# EAGLE design Reactor_Zero (EAGLE 9.5.1)
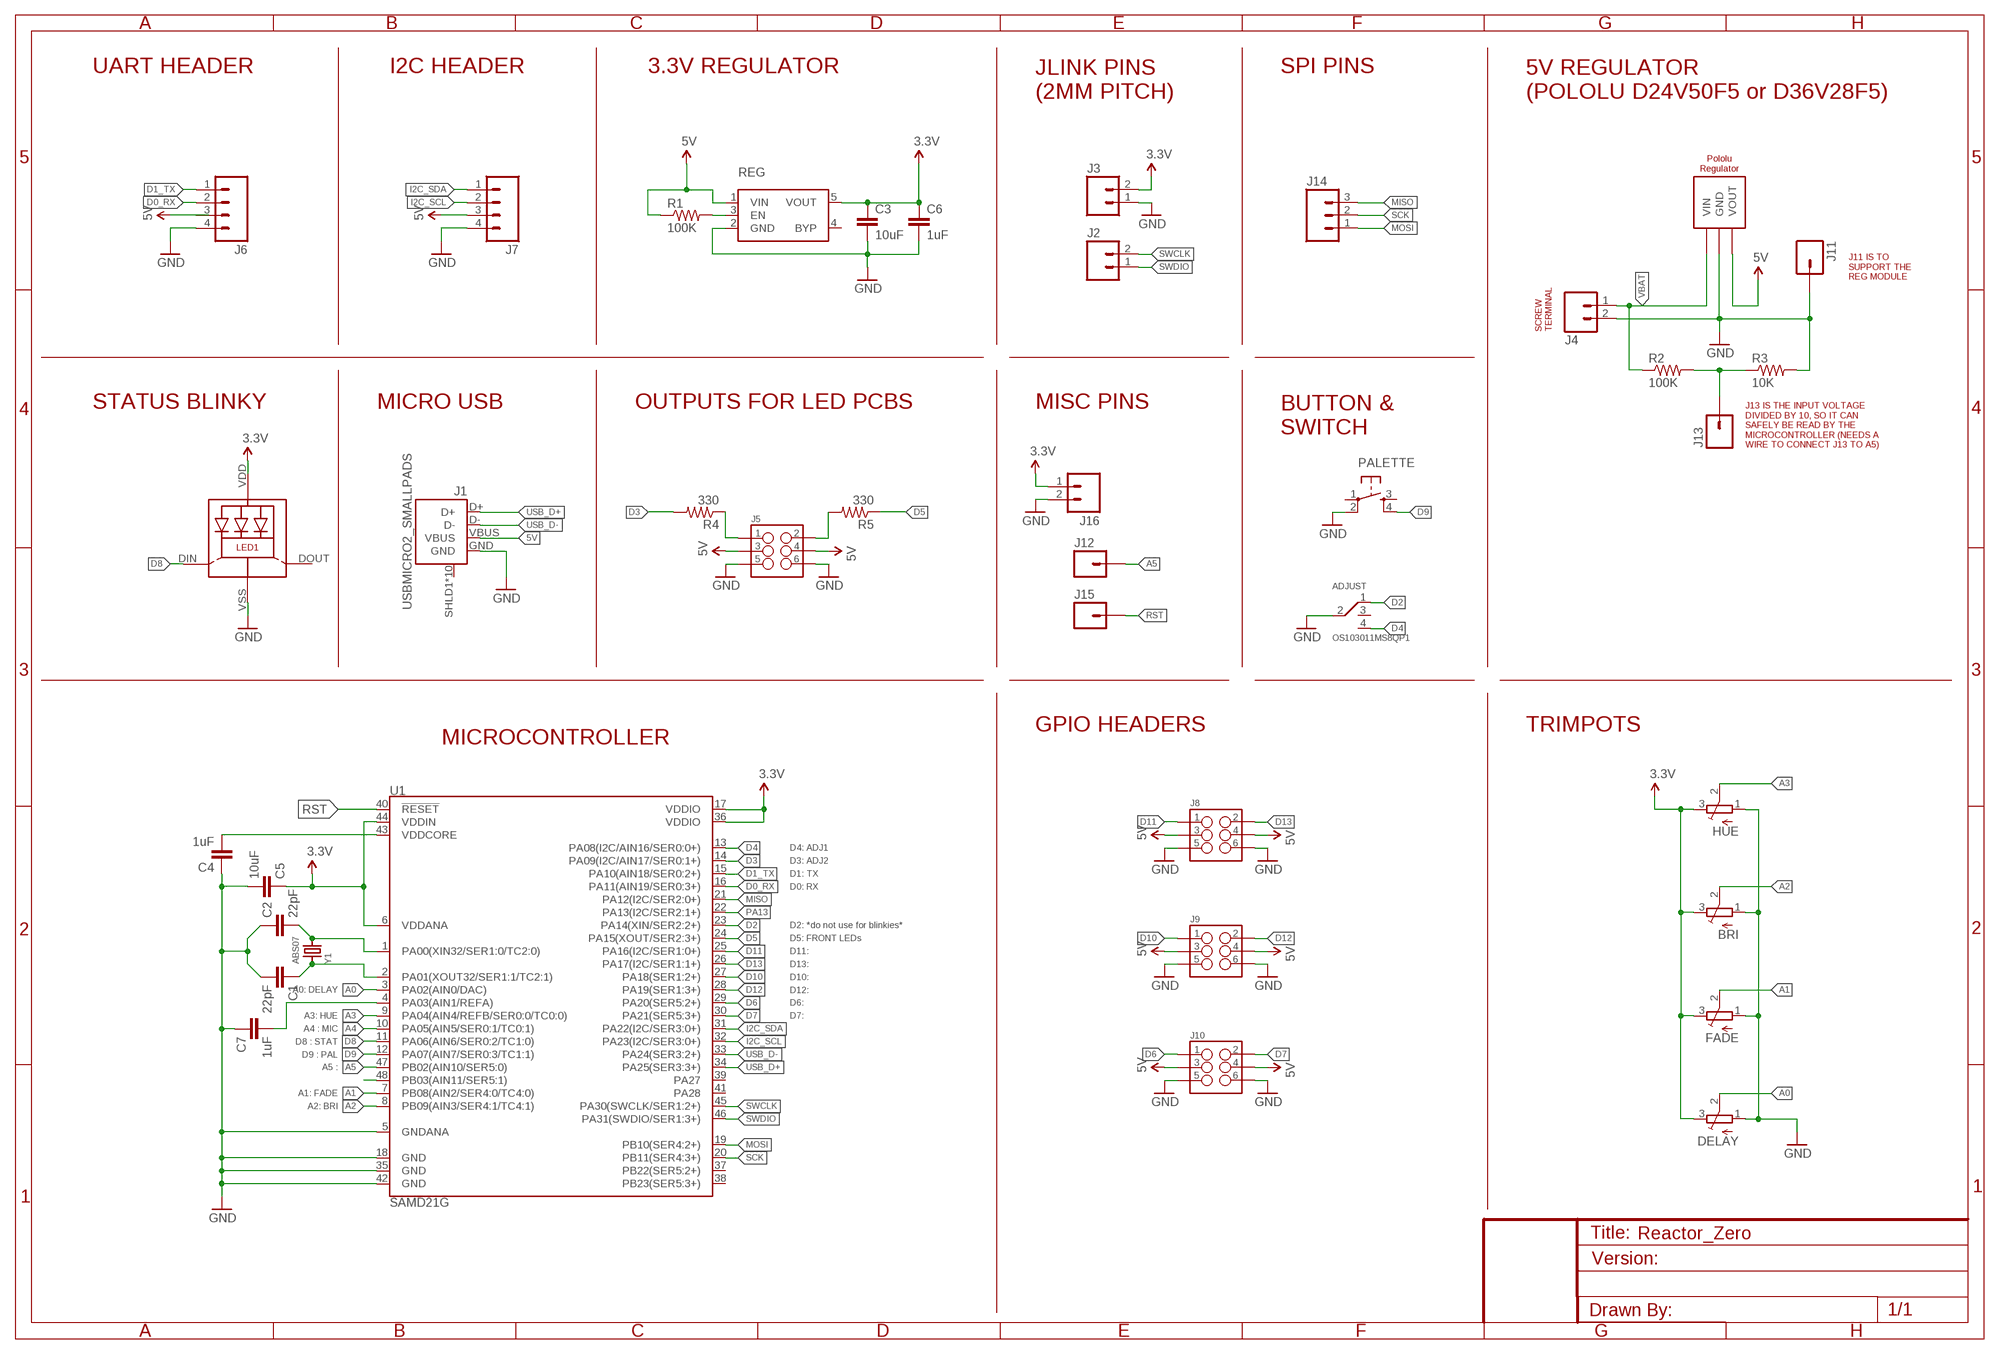
[diagram p0: schematic, sheet 1]

## Parts
ADJUST  OS103011MS8QP1  [OS103011MS8QP1]
BRI  TRIMPOTEVM3V  [EVM3V]
C1  22pF  C-EUC0603K  [C0603K]
C2  22pF  C-EUC0603K  [C0603K]
C3  10uF  C-EUC0805K  [C0805K]
C4  1uF  C-EUC0805K  [C0805K]
C5  10uF  C-EUC0805K  [C0805K]
C6  1uF  C-EUC0805K  [C0805K]
C7  1uF  C-EUC0805K  [C0805K]
DELAY  TRIMPOTEVM3V  [EVM3V]
FADE  TRIMPOTEVM3V  [EVM3V]
HUE  TRIMPOTEVM3V  [EVM3V]
J1  USBMICRO2_SMALLPADS  [USB-MICROB-10118194_SMALLPADS]
J2  M022MM  [1X02_NO_SILK_2MM]
J3  M022MM  [1X02_NO_SILK_2MM]
J4  M025MM  [SCREWTERMINAL-5MM-2]
J5  M03X22X3_SILK_MALE_PTH  [2X3]
J6  M04PTH  [1X04]
J7  M04PTH  [1X04]
J8  M03X22X3_SILK_MALE_PTH  [2X3]
J9  M03X22X3_SILK_MALE_PTH  [2X3]
J10  M03X22X3_SILK_MALE_PTH  [2X3]
J11  M01PTH  [1X01]
J12  M01PTH  [1X01]
J13  M01PTH  [1X01]
J14  M03PTH  [1X03]
J15  M01PTH  [1X01]
J16  M02PTH  [1X02]
LED1  WS2812BSK6812MINI-WIDE  [SK6812MINI-WIDE]
PALETTE  TAC_SWITCHPTH  [TACTILE-PTH]
R1  100K  R-US_R0603  [R0603]
R2  100K  R-US_R0603  [R0603]
R3  10K  R-US_R0603  [R0603]
R4  330  R-US_R0603  [R0603]
R5  330  R-US_R0603  [R0603]
REG  SPX3819  [SOT23-5]
U1  SAMD21G  ATSAMD21G-A_SMPADS  [TQFP-48_SMALL_PADS]
U$1  POLOLU_REGD24V50FS_NO_HOLES  [D24V50F5_NO_HOLES]
Y1  ABS07  ABRACON_CRYSTAL.ABS07  [ABS07]

## Nets
3.3V [PWR]: BRI.3(E) C3.1 C5.1 C6.1 DELAY.3(E) FADE.3(E) HUE.3(E) J3.2 J16.1 LED1.VDD REG.5(VOUT) U1.6(VDDANA) U1.17(VDDIO) U1.36(VDDIO) U1.44(VDDIN)
5V [PWR]: J1.VBUS J5.3 J5.4 J6.3 J7.3 J8.3 J8.4 J9.3 J9.4 J10.3 J10.4 R1.1 REG.1(VIN) U$1.VOUT
A0: DELAY.2(S) U1.3(PA02(AIN0/DAC))
A1: FADE.2(S) U1.7(PB08(AIN2/SER4:0/TC4:0))
A2: BRI.2(S) U1.8(PB09(AIN3/SER4:1/TC4:1))
A3: HUE.2(S) U1.9(PA04(AIN4/REFB/SER0:0/TC0:0))
A4: U1.10(PA05(AIN5/SER0:1/TC0:1))
A5: J12.1 U1.47(PB02(AIN10/SER5:0))
AREF: C7.2 U1.4(PA03(AIN1/REFA))
D0_RX: J6.2 U1.16(PA11(AIN19/SER0:3+))
D1_TX: J6.1 U1.15(PA10(AIN18/SER0:2+))
D2: ADJUST.1(T1) U1.23(PA14(XIN/SER2:2+))
D3: R4.2 U1.14(PA09(I2C/AIN17/SER0:1+))
D4: ADJUST.4(T3) U1.13(PA08(I2C/AIN16/SER0:0+))
D5: R5.1 U1.24(PA15(XOUT/SER2:3+))
D6: J10.1 U1.29(PA20(SER5:2+))
D7: J10.2 U1.30(PA21(SER5:3+))
D8: LED1.DIN(DI) U1.11(PA06(AIN6/SER0:2/TC1:0))
D9: PALETTE.4 U1.12(PA07(AIN7/SER0:3/TC1:1))
D10: J9.1 U1.27(PA18(SER1:2+))
D11: J8.1 U1.25(PA16(I2C/SER1:0+))
D12: J9.2 U1.28(PA19(SER1:3+))
D13: J8.2 U1.26(PA17(I2C/SER1:1+))
DIV: J13.1 R2.2 R3.1
GND [PWR]: ADJUST.2(P) BRI.1(A) C1.2 C2.1 C3.2 C4.1 C5.2 C6.2 C7.1 DELAY.1(A) FADE.1(A) HUE.1(A) J1.GND J3.1 J4.2 J5.5 J5.6 J6.4 J7.4 J8.5 J8.6 J9.5 J9.6 J10.5 J10.6 J11.1 J16.2 LED1.VSS(GND) PALETTE.2 R3.2 REG.2(GND) U1.5(GNDANA) U1.18(GND) U1.35(GND) U1.42(GND) U$1.GND1(GND) U$1.GND2(GND)
I2C_SCL: J7.2 U1.32(PA23(I2C/SER3:0+))
I2C_SDA: J7.1 U1.31(PA22(I2C/SER3:0+))
MISO: J14.3 U1.21(PA12(I2C/SER2:0+))
MOSI: J14.1 U1.19(PB10(SER4:2+))
N$1: C2.2 U1.1(PA00(XIN32/SER1:0/TC2:0)) Y1.2
N$2: C1.1 U1.2(PA01(XOUT32/SER1:1/TC2:1)) Y1.1
N$3: J5.2 R5.2
N$4: R1.2 REG.3(EN)
N$5: J5.1 R4.1
N$6: C4.2 U1.43(VDDCORE)
N$11: U1.48(PB03(AIN11/SER5:1))
PA13: U1.22(PA13(I2C/SER2:1+))
RST: J15.1 U1.40(!RESET!)
SCK: J14.2 U1.20(PB11(SER4:3+))
SWCLK: J2.2 U1.45(PA30(SWCLK/SER1:2+))
SWDIO: J2.1 U1.46(PA31(SWDIO/SER1:3+))
USB_D+: J1.D+ U1.34(PA25(SER3:3+))
USB_D-: J1.D- U1.33(PA24(SER3:2+))
VBAT [BIGPWR]: J4.1 R2.1 U$1.VIN
Unconnected: ADJUST.3(T2) J1.SHLD1(SHIELD) J1.SHLD2(SHIELD) J1.SHLD3(SHIELD) J1.SHLD4(SHIELD) J1.SHLD5(SHIELD) J1.SHLD6(SHIELD) J1.SHLD7(SHIELD) J1.SHLD8(SHIELD) J1.SHLD9(SHIELD) J1.SHLD10(SHIELD) LED1.DOUT(DO) PALETTE.1 PALETTE.3 REG.4(BYP) U1.37(PB22(SER5:2+)) U1.38(PB23(SER5:3+)) U1.39(PA27) U1.41(PA28)

## Notes on the sheet
- UART HEADER | I2C HEADER | 3.3V REGULATOR | SPI PINS
- JLINK PINS
  (2MM PITCH)
- 5V REGULATOR
  (POLOLU D24V50F5 or D36V28F5)
- J11 IS TO
  SUPPORT THE
  REG MODULE
- SCREW
  TERMINAL
- STATUS BLINKY | MICRO USB | OUTPUTS FOR LED PCBS | MISC PINS
- BUTTON &
  SWITCH
- J13 IS THE INPUT VOLTAGE
  DIVIDED BY 10, SO IT CAN
  SAFELY BE READ BY THE
  MICROCONTROLLER (NEEDS A
  WIRE TO CONNECT J13 TO A5)
- GPIO HEADERS | TRIMPOTS
- MICROCONTROLLER
- D4: ADJ1
  D3: ADJ2
  D1: TX
  D0: RX
  
  
  D2: *do not use for blinkies*
  D5: FRONT LEDs
  D11: 
  D13: 
  D10: 
  D12: 
  D6: 
  D7:
- A0: DELAY
  
  A3: HUE
  A4 : MIC
  D8 : STAT
  D9 : PAL
  A5 :
  
  A1: FADE
  A2: BRI

## Library data of the parts
ADJUST = rseries:OS103011MS8QP1
BRI DELAY FADE HUE = rseries:TRIMPOT: Panasonic SMT trimmer potentiometer part number EVM3V http://industrial.panasonic.com/www-data/pdf/AOI0000/AOI0000CE4.pdf
C1-C7 = rcl:C-EU: CAPACITOR, European symbol
J1 = rseries:USB: USB Connectors
J2 J3 = rseries:M02: Standard 2-pin 0.1" header. Use with - straight break away headers ( PRT-00116) - right angle break away headers (PRT-00553) - swiss pins (PRT-00743) - machine pins (PRT-00117) - female headers (PRT-00115) Molex polarized connector foot print use with: PRT-08233 with associated crimp pins and housings. 2.54_SCREWTERM for use with PRT-10571. 3.5mm Screw Terminal footprints for PRT-08084 5mm Screw Terminal footprints for use with PRT-08432
J4 = rseries:M02: Standard 2-pin 0.1" header. Use with - straight break away headers ( PRT-00116) - right angle break away headers (PRT-00553) - swiss pins (PRT-00743) - machine pins (PRT-00117) - female headers (PRT-00115) Molex polarized connector foot print use with: PRT-08233 with associated crimp pins and housings. 2.54_SCREWTERM for use with PRT-10571. 3.5mm Screw Terminal footprints for PRT-08084 5mm Screw Terminal footprints for use with PRT-08432; STOREFRONT_ID: PRT-08432
J5 J8-J10 = SparkFun-Connectors:M03X2: 2x3 .1" header. Shrouded, with keying- CONN-10681 SMT- CONN-11415 Pogo pins- HW-11044; PROD_ID: CONN-09701
J6 J7 = SparkFun-Connectors:M04: Header 4 Standard 4-pin 0.1" header. Use with straight break away headers (SKU : PRT-00116), right angle break away headers (PRT-00553), swiss pins (PRT-00743), machine pins (PRT-00117), and female headers (PRT-00115). Molex polarized connector foot print use with SKU : PRT-08231 with associated crimp pins and housings. 1MM SMD Version SKU: PRT-10208; PROD_ID: CONN-09696
J11-J13 J15 = SparkFun-Connectors:M01: Header 1 Standard 1-pin 0.1" header. Use with straight break away headers (SKU : PRT-00116), right angle break away headers (PRT-00553), swiss pins (PRT-00743), machine pins (PRT-00117), and female headers (PRT-00115). SMTSO-256-ET is a "flush mount" nut for a 4-40 screw. The older package used to be too tight, and did not allow it to sit properly thru the drill hit. The latest (0.165DIA) fits nice and snug.
J14 = SparkFun-Connectors:M03: Header 3 Standard 3-pin 0.1" header. Use with straight break away headers (SKU : PRT-00116), right angle break away headers (PRT-00553), swiss pins (PRT-00743), machine pins (PRT-00117), and female headers (PRT-00115). Molex polarized connector foot print use with SKU : PRT-08232 with associated crimp pins and housings.
J16 = SparkFun-Connectors:M02: Standard 2-pin 0.1" header. Use with - straight break away headers ( PRT-00116) - right angle break away headers (PRT-00553) - swiss pins (PRT-00743) - machine pins (PRT-00117) - female headers (PRT-00115) Molex polarized connector foot print use with: PRT-08233 with associated crimp pins and housings. 2.54_SCREWTERM for use with PRT-10571. 3.5mm Screw Terminal footprints for PRT-08084 5mm Screw Terminal footprints for use with PRT-08432
LED1 = rseries:WS2812B: WS2812B is the 4-pin variant of the WS2812 http://www.mikrocontroller.net/attachment/180459/WS2812B_preliminary.pdf based on WS2812 from https://github.com/adafruit/Adafruit-Eagle-Library
PALETTE = rseries:TAC_SWITCH: Momentary Switch Button commonly used for reset or general input. Spark Fun Electronics SKU : COM-00097 SMT- SWCH-08247
R1-R5 = rcl:R-US_: RESISTOR, American symbol
REG = rseries:SPX3819: SPX3819 500mA LDO Voltage Regulator
U1 = rseries:ATSAMD21G: Atmel SAMD21G SMART ARM-Based Microcontroller The Atmel ® | SMART ™ SAM D21 is a series of low-power microcontrollers using the 32-bit ARM ® Cortex ® -M0+ processor, and ranging from 32- to 64-pins with up to 256KB Flash and 32KB of SRAM. The SAM D21 devices operate at a maximum frequency of 48MHz and reach 2.46 CoreMark/MHz. They are designed for simple and intuitive migration with identical peripheral modules, hex compatible code, identical linear address map and pin compatible migration paths between all devices in the product series. All devices include intelligent and flexible peripherals, Atmel Event System for inter-peripheral signaling, and support for capacitive touch button, slider and wheel user interfaces.
U$1 = rseries:POLOLU_REG: D24V22F5 Regulator Module from Pololu (product ID D24V22F5). 6V-36V input , 5V 2.5A output https://www.pololu.com/product/2858
Y1 = rseries:ABRACON_CRYSTAL

## Net classes
1 PWR: width 0.279 mm, clearance 0.254 mm
2 BIGPWR: width 1.676 mm, clearance 0.381 mm

## Board
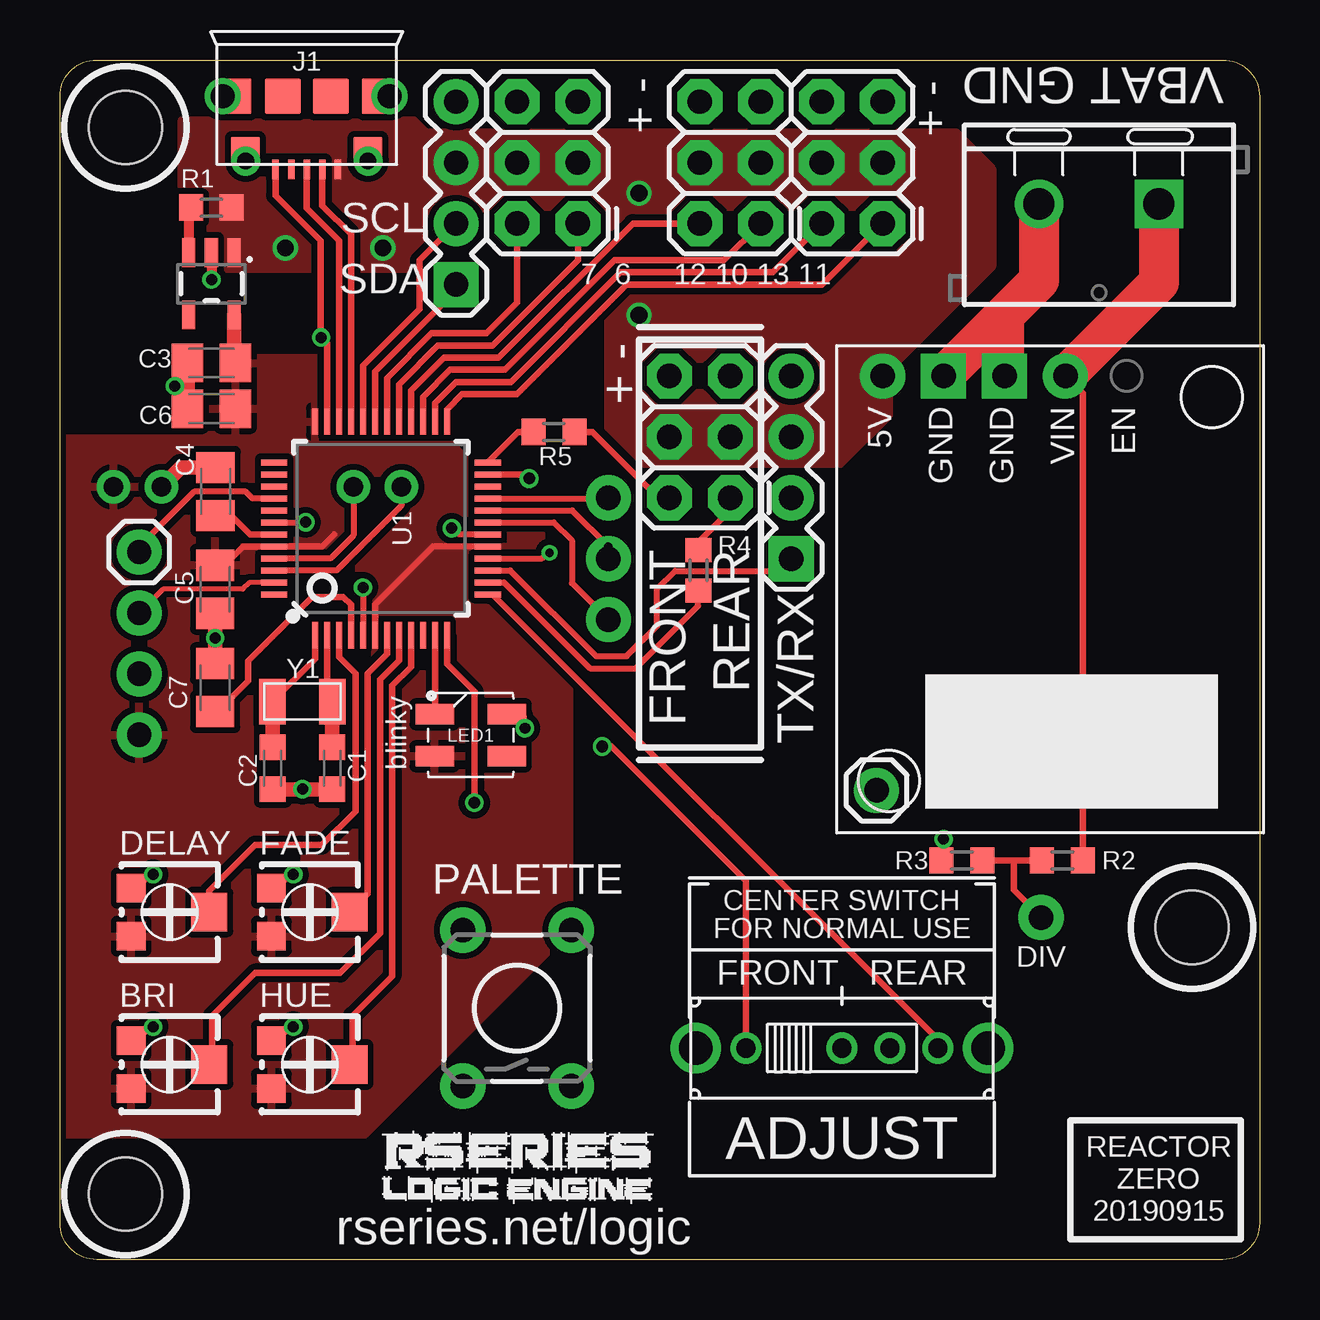
[diagram p1: board, top side]
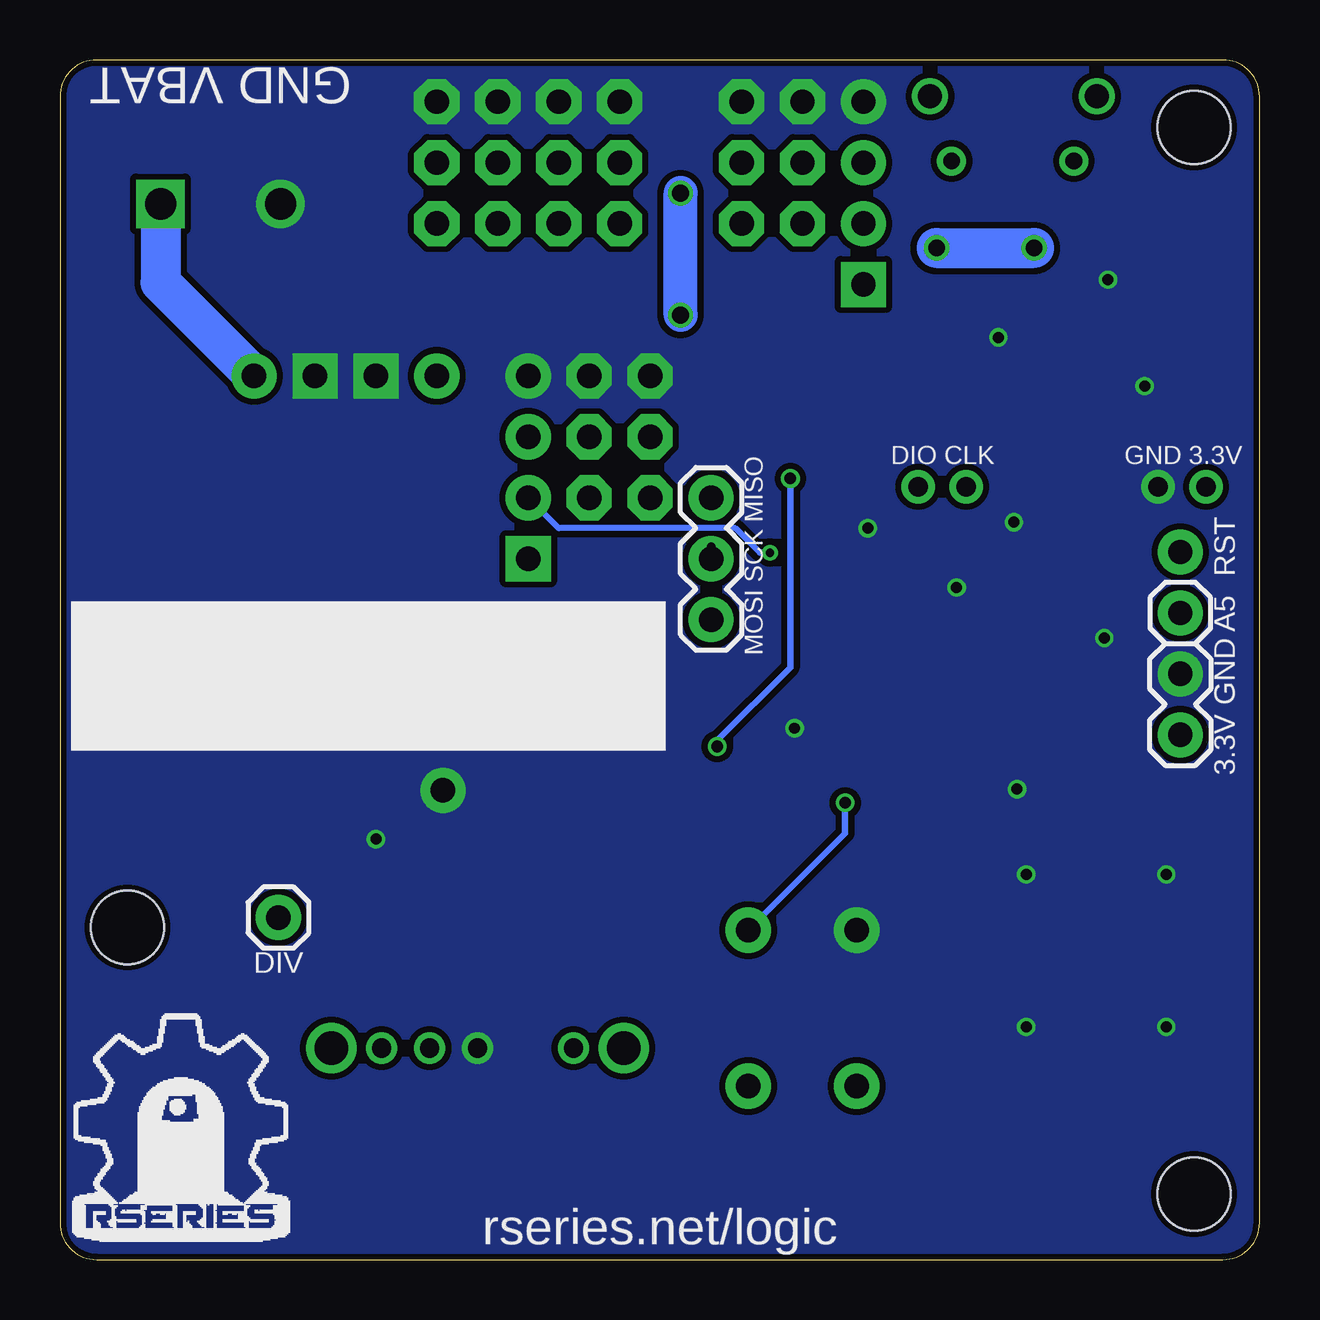
[diagram p2: board, bottom side, seen from below]

Size 50 x 50 mm. Coordinates in mm from the lower left corner, seen from the top.
Outline: 48.48,0 1.52,0 arc-90 0,1.52 0,48.48 arc-90 1.52,50 48.48,50 arc-90 50,48.48 50,1.52 arc-90 48.48,0
Copper layers (1*16): Top 0.035mm / dielectric 1.5mm / Bottom 0.035mm
Design rules "dirt_cheap_dirty_boards.v1": minimum track width 5mil, minimum drill 12mil, track to track 5mil, track to pad 5mil, pad to pad 5mil, via to via 5mil, smd to smd 0mil, copper to edge 10mil, drill to drill 10mil, minimum pad ring 10mil, minimum via ring 6mil, stop-mask expansion 2mil, vias tented up to drill 25mil, thermal gap 10mil
Holes 3.05 mm at 2.73,47.18 2.73,2.73 47.18,13.84

### Footprints (pad centres in the part's own frame; a part is rotated, then mirrored left to right if it is on the bottom)
OS103011MS8QP1 = drill 0.8: 1 -4,0; 2 0,0; 3 2,0; 4 4,0 | drill 1.4: MT1 -6.1,0; MT2 6.1,0
EVM3V = smd 1.2 x 1.2: 1 -1,-1.6; 3 1,-1.6 | smd 1.6 x 1.5: 2 0,1.65
C0603K = smd 1.05 x 1.08: 1 -0.875,0; 2 0.875,0
C0805K = smd 1.3 x 1.6: 1 -1,0; 2 1,0
USB-MICROB-10118194_SMALLPADS = smd 0.8 x 0.3: D+ -2.9,0; D- -2.9,-0.65; GND -2.9,1.3; ID -2.9,0.65; VBUS -2.9,-1.3 | drill 0.7: SHLD1 -2.55,2.55; SHLD2 -2.55,-2.55 | drill 1: SHLD3 0.15,3.5; SHLD4 0.15,-3.45 | smd 1.5 x 1.1: SHLD5 0.15,2.85; SHLD6 0.15,-2.85 | smd 1.5 x 1.5: SHLD7 0.15,1; SHLD8 0.15,-1 | smd 1 x 1.2: SHLD9 -2.05,-2.55; SHLD10 -2.05,2.55
1X02_NO_SILK_2MM = drill 0.8 pad 1.4: 1 -1,0; 2 1,0
SCREWTERMINAL-5MM-2 = drill 1.3 pad 2.032 square: 1 0,0 | drill 1.3 pad 2.032: 2 5,0
2X3 = drill 1.016 pad 1.88 octagon: 1 0,0; 2 0,2.54; 3 2.54,0; 4 2.54,2.54; 5 5.08,0; 6 5.08,2.54
1X04 = drill 1.016 pad 1.88 square: 1 0,0 | drill 1.016 pad 1.88: 2 2.54,0; 3 5.08,0; 4 7.62,0
1X01 = drill 1.016 pad 1.88: 1 0,0
1X03 = drill 1.016 pad 1.88: 1 0,0; 2 2.54,0; 3 5.08,0
1X02 = drill 1.016 pad 1.88: 1 0,0; 2 2.54,0
SK6812MINI-WIDE = smd 1.6 x 0.85: DIN 1.5,-0.875; DOUT -1.5,0.875; VDD 1.5,0.875; VSS -1.5,-0.875
TACTILE-PTH = drill 1.016 pad 1.88: 1 -3.251,2.261; 2 3.251,2.261; 3 -3.251,-2.261; 4 3.251,-2.261
R0603 = smd 1 x 1.1: 1 -0.85,0; 2 0.85,0
SOT23-5 = smd 0.55 x 1.2: 1 -0.95,-1.3; 2 0,-1.3; 3 0.95,-1.3; 4 0.95,1.3; 5 -0.95,1.3
TQFP-48_SMALL_PADS = smd 1.1 x 0.25: 1 -4.45,2.75; 2 -4.45,2.25; 3 -4.45,1.75; 4 -4.45,1.25; 5 -4.45,0.75; 6 -4.45,0.25; 7 -4.45,-0.25; 8 -4.45,-0.75; 9 -4.45,-1.25; 10 -4.45,-1.75; 11 -4.45,-2.25; 12 -4.45,-2.75; 25 4.45,-2.75; 26 4.45,-2.25; 27 4.45,-1.75; 28 4.45,-1.25; 29 4.45,-0.75; 30 4.45,-0.25; 31 4.45,0.25; 32 4.45,0.75; 33 4.45,1.25; 34 4.45,1.75; 35 4.45,2.25; 36 4.45,2.75 | smd 0.25 x 1.1: 13 -2.75,-4.45; 14 -2.25,-4.45; 15 -1.75,-4.45; 16 -1.25,-4.45; 17 -0.75,-4.45; 18 -0.25,-4.45; 19 0.25,-4.45; 20 0.75,-4.45; 21 1.25,-4.45; 22 1.75,-4.45; 23 2.25,-4.45; 24 2.75,-4.45; 37 2.75,4.45; 38 2.25,4.45; 39 1.75,4.45; 40 1.25,4.45; 41 0.75,4.45; 42 0.25,4.45; 43 -0.25,4.45; 44 -0.75,4.45; 45 -1.25,4.45; 46 -1.75,4.45; 47 -2.25,4.45; 48 -2.75,4.45
D24V50F5_NO_HOLES = drill 1.016 pad 1.88 square: GND1 1.905,-8.89; GND2 4.445,-8.89 | drill 1.016 pad 1.88: VIN -0.635,-8.89; VOUT 6.985,-8.89
ABS07 = smd 1.1 x 1.9: 1 -1.25,0; 2 1.25,0

### Placement (x,y rotation side)
ADJUST  32.59,8.82 0 top
BRI  4.57,8.13 270 top
C1  11.35,20.48 270 top
C2  8.87,20.48 90 top
C3  6.31,37.37 180 top
C4  6.49,32.02 270 top
C5  6.47,27.94 270 top
C6  6.31,35.47 180 top
C7  6.47,23.84 270 top
DELAY  4.57,14.48 270 top
FADE  10.41,14.48 270 top
HUE  10.41,8.13 270 top
J1  10.29,48.34 90 top
J2  13.23,32.21 180 top
J3  3.23,32.21 180 top
J4  45.81,44 180 top
J5  27.94,31.75 90 top
J6  30.48,29.21 90 top
J7  16.51,40.64 90 top
J8  34.29,43.18 90 top
J9  29.21,43.18 90 top
J10  21.59,43.18 90 top
J11  34.04,19.56 0 top
J12  3.3,26.95 0 bottom
J13  40.89,14.26 0 bottom
J14  22.86,26.67 90 bottom
J15  3.3,29.49 0 top
J16  3.3,21.87 90 bottom
LED1  17.12,21.85 180 top
PALETTE  19.05,10.48 90 top
R1  6.31,43.85 180 top
R2  41.78,16.64 180 top
R3  37.59,16.64 180 top
R4  26.61,28.73 270 top
R5  20.59,34.5 0 top
REG  6.31,40.67 180 top
U1  13.38,30.48 90 top
U$1  41.27,27.94 180 top
U$2  [RSERIES_SMALL]  44.96,7.62 0 bottom
U$4  [RSERIES-LE-LOGO2]  19.05,3.56 0 top
Y1  10.1,23.26 180 top

### Tracks (layer width: path | path; a pad name or v marks a point on that pad's centre or on a via)
3.3V
  Top 0.254: U1.17 15.56,29.73
  Top 0.279: U1.6 13.13,27.29 15.56,29.73 | 11.43,30.23 10.93,29.73 U1.44 7.63,29.73 6.86,28.96
  Top 0.61: REG.5 7.26,37.37 C3.1
  pour Top: -2.54,5.21 -2.54,34.25 4.57,34.25 7.62,37.59 12.7,37.59 21.21,29.08 21.21,13.72 12.7,5.21
5V  (via drill 0.7)
  Bottom 1.422: v24.13,39.37 v24.13,44.45
  Bottom 1.676: v13.46,42.16 v9.4,42.16
  pour Top (no thermals): 5.08,47.5 14.73,47.5 15.24,46.99 37.34,46.99 38.86,45.47 38.86,41.4 34.54,37.08 34.54,35.18 32.51,33.15 24.38,33.15 22.86,34.67 22.86,40.13 21.72,41.27 5.08,41.27
A0
  Top 0.279: U1.3 11.63,25.12 12.32,24.43 12.32,18.68 10.91,17.27 8.13,17.27 6.22,15.37 DELAY.2
A1
  Top 0.279: U1.7 13.63,25.23 12.83,24.43 12.83,15.24 FADE.2 12.19,14.61
A2
  Top 0.279: U1.8 14.13,24.97 13.34,24.18 13.34,13.59 11.68,11.94 8.13,11.94 6.35,10.16 6.35,8.26 BRI.2
A3
  Top 0.279: U1.9 14.63,24.71 13.84,23.92 13.84,11.81 12.19,10.16 12.19,8.26 HUE.2
A5
  Top 0.203: J12.1 4.29,27.94 7.62,27.94 7.91,28.23 U1.47
AREF
  Top 0.279: U1.4 12.13,27.29 11.81,27.61 10.52,27.61 7.85,24.94 7.85,24.11 6.58,22.84 C7.2
D0_RX  (via drill 0.35)
  Top 0.254: U1.16 20.08,29.23 20.32,29.46 v20.41,29.46
  Bottom 0.254: v20.41,29.46 20.83,29.46 21.84,30.48 29.21,30.48 J6.2
D1_TX
  Top 0.254: U1.15 18.77,28.73 22.35,25.15 23.62,25.15 24.89,26.42 24.89,27.94 25.65,28.7 29.97,28.7 J6.1
D2  (via drill 0.48)
  Top 0.279: U1.23 19.39,32.73 v19.56,32.56 | v22.61,21.38 22.99,21.38 28.59,15.78 ADJUST.1
  Bottom 0.279: v19.56,32.56 19.56,24.69 22.61,21.64 v22.61,21.38
D3
  Top 0.254: U1.14 18.51,28.23 22.1,24.64 23.99,24.64 26.6,27.24 R4.2
D4
  Top 0.279: U1.13 18.04,27.73 36.59,9.17 ADJUST.4
D5
  Top 0.279: R5.1 19.1,34.5 U1.24
D6
  Top 0.279: U1.29 14.13,36.48 15.75,38.1 18.03,38.1 21.59,41.66 J10.1
D7
  Top 0.279: U1.30 13.63,36.74 15.49,38.61 17.78,38.61 19.05,39.88 J10.2
D8
  Top 0.279: U1.11 LED1.DIN
D9  (via drill 0.48)
  Top 0.279: U1.12 16.13,24.82 17.27,23.67 v17.27,19.04
  Bottom 0.279: v17.27,19.04 17.27,17.77 PALETTE.4
D10
  Top 0.279: U1.27 15.13,35.95 16.26,37.08 18.54,37.08 23.11,41.66 27.69,41.66 J9.1
D11
  Top 0.279: U1.25 16.13,35.43 16.76,36.07 19.05,36.07 23.62,40.64 31.75,40.64 J8.1
D12
  Top 0.279: U1.28 14.63,36.22 16,37.59 18.29,37.59 23.88,43.18 J9.2
D13
  Top 0.279: U1.26 15.63,35.69 16.51,36.58 18.8,36.58 23.37,41.15 29.72,41.15 J8.2
DIV
  Top 0.279: R2.2 39.75,16.64 | 39.75,16.64 R3.1 | 39.75,16.64 39.75,15.4 J13.1
GND  (via drill 0.46)
  Top 0.254: U1.18 16.63,30.23 v16.33,30.48 | v12.63,28.01 U1.5 | U1.42 v10.23,30.73 v10.24,30.73
  Top 0.279: LED1.VSS 19.3,22.73 v19.38,22.15 | J1.GND 8.99,44.35 10.87,42.47 10.87,38.45 v10.89,38.43 11.13,38.19 U1.35 | BRI.1 v3.88,9.7 | DELAY.1 v3.88,16.05 | FADE.1 v9.73,16.05 | HUE.1 v9.73,9.7 | v36.83,17.53 36.83,16.73 R3.2
  Top 0.406: REG.2 v6.31,40.85 | 5.31,37.64 5.31,37.43 v4.79,36.4 | C6.2 5.27,35.47 4.84,36.4
  Top 0.61: J3.1 5.04,33.02 C4.1 | C2.1 v10.11,19.6 v10.11,19.61 v10.11,19.6 C1.2 | C6.2 C3.2 5.31,37.64 | C5.2 v6.47,25.91 C7.1
  Top 1.676: J4.2 40.81,40.81 39.37,39.37 | 39.37,39.37 U$1.GND2 | U$1.GND1 39.37,39.37
  pour Bottom (no thermals): -8.89,56.69 63.5,56.69 63.5,-9.35 -8.89,-9.35
I2C_SCL
  Top 0.279: U1.32 12.63,37.26 14.99,39.62 14.99,41.66 J7.2
I2C_SDA
  Top 0.279: U1.31 13.13,37 16.51,40.39 J7.1
MISO  (via drill 0.35)
  Top 0.254: U1.21 v22.84,31.73
  Bottom 0.254: v22.84,31.73 J14.3
MOSI
  Top 0.254: U1.19 20.58,30.73 21.34,29.97 21.34,28.19 J14.1
N$1
  Top 0.279: U1.1 10.63,25.03 Y1.2
  Top 0.61: C2.2 8.87,23.24 Y1.2
N$2
  Top 0.279: U1.2 11.13,23.49 Y1.1
  Top 0.61: C1.1 Y1.1
N$3
  Top 0.279: R5.2 22.2,34.5 24.95,31.75 J5.2
N$4
  Top 0.406: R1.2 5.36,43.85 REG.3
N$5
  Top 0.279: R4.1 26.53,29.64 26.53,29.83 27.94,31.24 J5.1
N$6
  Top 0.279: U1.43 7.92,30.23 7.11,31.04 6.51,31.04 C4.2
RST
  Top 0.254: J15.1 3.3,29.72 5.59,32 7.75,32 8.02,31.73 U1.40
SCK  (via drill 0.35)
  Top 0.254: U1.20 21.35,31.23 v22.86,29.72
  Bottom 0.254: v22.86,29.72 J14.2
SWCLK
  Top 0.254: J2.2 12.23,30.18 11.27,29.23 U1.45
SWDIO
  Top 0.254: J2.1 14.23,31.42 11.54,28.73 U1.46
USB_D+
  Top 0.279: U1.34 11.63,42.48 10.29,43.81 J1.D+
USB_D-
  Top 0.279: U1.33 12.13,42.74 10.94,43.93 J1.D-
VBAT
  Top 0.279: 41.4,36.32 U$1.VIN 42.63,36.11 R2.1
  Top 1.676: J4.1 45.81,40.73 U$1.VIN
  Bottom 1.676: J4.1 45.81,40.73 U$1.VIN

### Text on the board
tPlace: VBAT GND | + - | + - | SCL / SDA | 7 6 12 10 13 11 | + - | FRONT / REAR | TX/RX | blinky | CENTER SWITCH / FOR NORMAL USE | DIV | FRONT REAR | REACTOR / ZERO / 20190915 | rseries.net/logic
bPlace: GND VBAT | GND 3.3V | DIO CLK | RST | MOSI SCK MISO | A5 | GND | 3.3V | DIV | rseries.net/logic